# Altium schematic sheet HALL_SENSOR_FILTER.SchDoc
size 431 x 279 mm; SheetNumber: 3; SheetTotal: 6
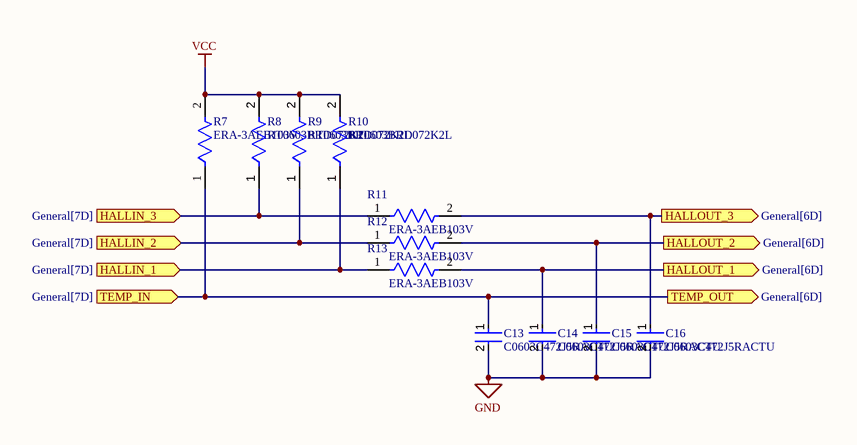
[diagram p0: HALL_SENSOR_FILTER.SchDoc]

## Parts
C13  C0603C472J5RACTU  [FP-C0603C-CF-MFG]
C14  C0603C472J5RACTU  [FP-C0603C-CF-MFG]
C15  C0603C472J5RACTU  [FP-C0603C-CF-MFG]
C16  C0603C472J5RACTU  [FP-C0603C-CF-MFG]
R7  ERA-3AEB103V  [FP-ERA3A-IPC_C]
R8  RT0603BRD072K2L  [FP-RT0603-MFG]
R9  RT0603BRD072K2L  [FP-RT0603-MFG]
R10  RT0603BRD072K2L  [FP-RT0603-MFG]
R11  ERA-3AEB103V  [FP-ERA3A-IPC_C]
R12  ERA-3AEB103V  [FP-ERA3A-IPC_C]
R13  ERA-3AEB103V  [FP-ERA3A-IPC_C]

## Ports
HALLIN_1 (in, see General[7D]), HALLIN_2 (in, see General[7D]), HALLIN_3 (in, see General[7D]), HALLOUT_1 (out, see General[6D]), HALLOUT_2 (out, see General[6D]), HALLOUT_3 (out, see General[6D]), TEMP_IN (in, see General[7D]), TEMP_OUT (out, see General[6D])

## Nets
GND: C13.2 C14.2 C15.2 C16.2
VCC: R7.2 R8.2 R9.2 R10.2
HALLIN_1: R10.1 R13.1 ; port HALLIN_1
HALLIN_2: R9.1 R12.1 ; port HALLIN_2
HALLIN_3: R8.1 R11.1 ; port HALLIN_3
HALLOUT_1: C14.1 R13.2 ; port HALLOUT_1
HALLOUT_2: C15.1 R12.2 ; port HALLOUT_2
HALLOUT_3: C16.1 R11.2 ; port HALLOUT_3
TEMP_IN: C13.1 R7.1 ; port TEMP_IN, port TEMP_OUT

## Notes on the sheet
- DWG. NO.
- REV.
- SHT.
- THIS DOCUMENT AND THE DATA DISCLOSED HEREIN OR HEREWITH IS THE PROPERTY OF ALTIUM LIMITED AND MAY BE FREELY DISTRIBUTED IN WHOLE. NO RIGHTS ARE RESERVED OR EXPRESS OR IMPLIED WARANTEE GIVEN.
- REVISION
- DESCRIPTION
- DATE
- APPROVED
- ENG:
- APPROVALS
- PROJECT
- DSN:
- CHK:
- REFERENCE DOCUMENTS
- PROJECT REVISION:
- TITLE
- DOCUMENT REVISION:
- DESIGN ITEM:
- BOM:
- FAB DWG:
- PCB DWG:
- ASSY DWG:
- SCALE:
- SIZE
- B
- CAGE CODE
- FILE NAME
- DWG NO.
- SHEET
- OF
- REV

## Library data of the parts
C13-C16 = CMP-1035-02202-3: C0603C 4.7nF Ceramic Multilayer Capacitor; 50 VDC; +125degC; X7R Dielec; +/-5%; Manufacturer: KEMET; Tolerance: 0.05; Capacitance: 4,700 pF; Temperature Coefficient: 30ppm/°C; Value: 4,700 pF; Automotive Grade: Grade 1; Voltage Rating: 50 V; Description: C0603 4,700 pF X7R 30ppm/°C 5.00% 50 V; Device Class L2: Capacitors; Temperature Range Low: -55°C; Automotive: Yes; Manufacturer Part Number: C0603C472J5RACTU; Height: 0.87mm; ComponentLink2Description: Datasheet; Mouser Description: Multilayer Ceramic Capacitors MLCC - SMD/SMT 50volts 4700pF X7R 5%; Material: Ceramic; Device Class L3: Ceramic Capacitors; Device Class L1: Passive Components; Category: Cap; Temperature: -55°C to +125°C; Octopart: https://octopart.com/c0603c472j5ractu-kemet-107195; Digikey Description: C0603C 4.7nF Ceramic Multilayer Capacitor; 50 VDC; +125degC; X7R Dielec; +/-5%; Package: C0603C-CF; Lead Free: Yes; RoHS: TRUE; ComponentLink2URL: https://api.kemet.com/component-edge/download/datasheet/C0603C100J5GACAUTO.pdf; Temperature Range High: +125°C; Temperature Characteristic: X7R
R7 R11-R13 = CMP-2000-00874-2: RES SMD 10K OHM 0.1% 1/10W 0603; Voltage Rating (DC): 75V; Power Rating: 100mW; Resistance: 10kR; Temperature Coefficient: 25ppm/°C; Radiation Hardening: No; Width: 0.8mm; Depth: 0.8mm; Construction: Rectangular; Case Code (Metric): 1608; Package Quantity: 5000; Length: 1.6mm; Size Code: 0603; Case Code (Imperial): 0603; Termination: SMD/SMT; Contact Plating: Tin; Resistance Tolerance: 0.1%; Military Standard: Not; Packaging: Tape and Reel; Max Power Dissipation: 100mW; REACH SVHC: No SVHC; Series: ERA-3A; Voltage Rating: 75V; Lead Free: Lead Free; Technology: METAL FILM; RoHS Compliant: Yes; Max Operating Temperature: 155°C; Resistor Type: Thin Film; Min Operating Temperature: -55°C; Number of Pins: 2; Case/Package: 0603; Tolerance: 0.1%; Height: 0.45mm; Mount: Surface Mount; Number of Terminations: 2
R8-R10 = CMP-2000-04423-2: RES 2.20K OHM 1/10W .1% SMD 0603; Manufacturer: Yageo; Power Rating: 0.1W; Tolerance: 0.001; Value: 2.2KΩ; Voltage Rating: 75V; Temperature Coefficient: 25 ppm/°C; Description: RT0603 2.2KΩ 0.1W 25 ppm/°C 0.10%; Series: RT; Manufacturer Part Number: RT0603BRD072K2L; ComponentLink2URL: http://www.yageo.com/documents/recent/PYu-RT_1-to-0.01_RoHS_L_9.pdf; Octopart: https://octopart.com/rt0603brd072k2l-yageo-1186019; Digikey Description: RES 2.20K OHM 1/10W .1% SMD 0603; Device Class L1: Passive Components; Temperature: -55°C to +155°C; ComponentLink2Description: Datasheet; Mouser Description: High Precision-High Stability Chip Resistor Thin Film 0603 2.2kOhm 0.1% Paper T/R; RoHS: TRUE; Footprint Url: http://www.yageo.com/exep/pages/download/literatures/PYu-R_Mount_10.pdf; Height: 0.55mm; Device Class L2: Resistors; Temperature Range Low: -55°C; Ipc Land Pattern Name: RESC16080X45; Composition: Thin Film; Lead Free: Yes; Temperature Range High: +155°C; Category: Res; Automotive: No; Resistance: 2.2KΩ; Package: RT0603; Device Class L3: Chip SMD Resistors